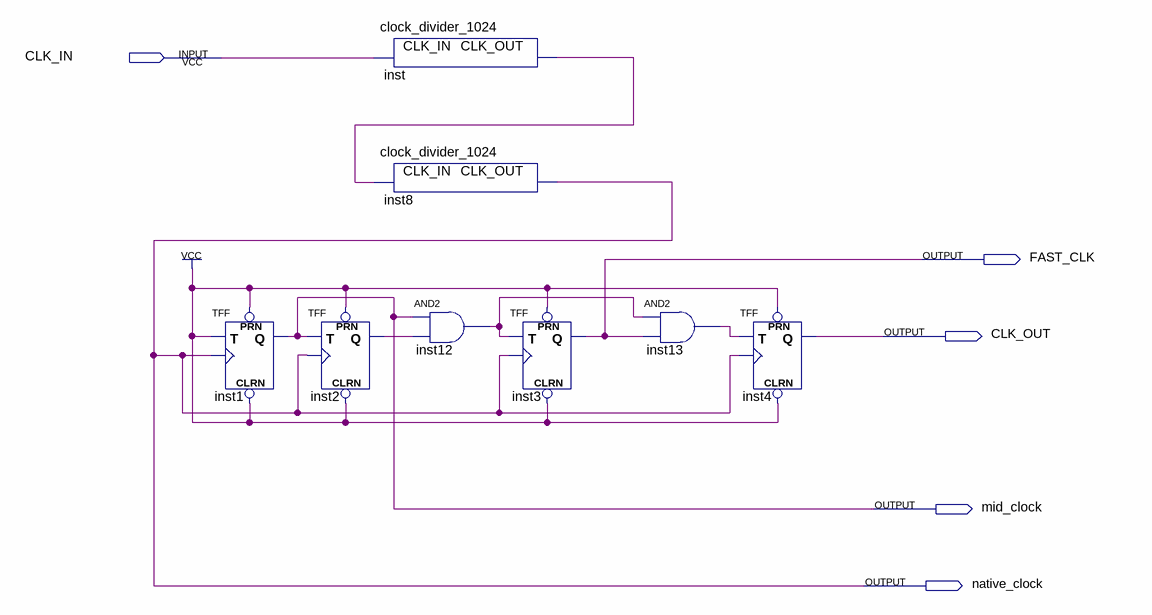
[diagram p0: schematic sheet]
// Quartus schematic clock_generator.bdf as structural Verilog: 8 symbols, 5 pins
module clock_generator (
  input  CLK_IN,
  output FAST_CLK,
  output CLK_OUT,
  output mid_clock,
  output native_clock
);

  wire inst2_q, inst12_out, inst13_out, inst_clk_out;

  TFF inst1 (.PRN(1'b1), .CLRN(1'b1), .T(1'b1), .CLK(native_clock), .Q(mid_clock));
  TFF inst2 (.PRN(1'b1), .CLRN(1'b1), .T(mid_clock), .CLK(native_clock), .Q(inst2_q));
  clock_divider_1024 inst (.CLK_IN(CLK_IN), .CLK_OUT(inst_clk_out));
  clock_divider_1024 inst8 (.CLK_IN(inst_clk_out), .CLK_OUT(native_clock));
  and inst12 (inst12_out, mid_clock, inst2_q);
  TFF inst3 (.PRN(1'b1), .CLRN(1'b1), .T(inst12_out), .CLK(native_clock), .Q(FAST_CLK));
  and inst13 (inst13_out, inst12_out, FAST_CLK);
  TFF inst4 (.PRN(1'b1), .CLRN(1'b1), .T(inst13_out), .CLK(native_clock), .Q(CLK_OUT));
endmodule
